# Altium schematic sheet Diagrama Final.SchDoc: Plataforma para robótica de enjambre fase 2
size A4; DrawnBy: Javier Lima; Revision: Pablo Mazariegos; SheetNumber: 1
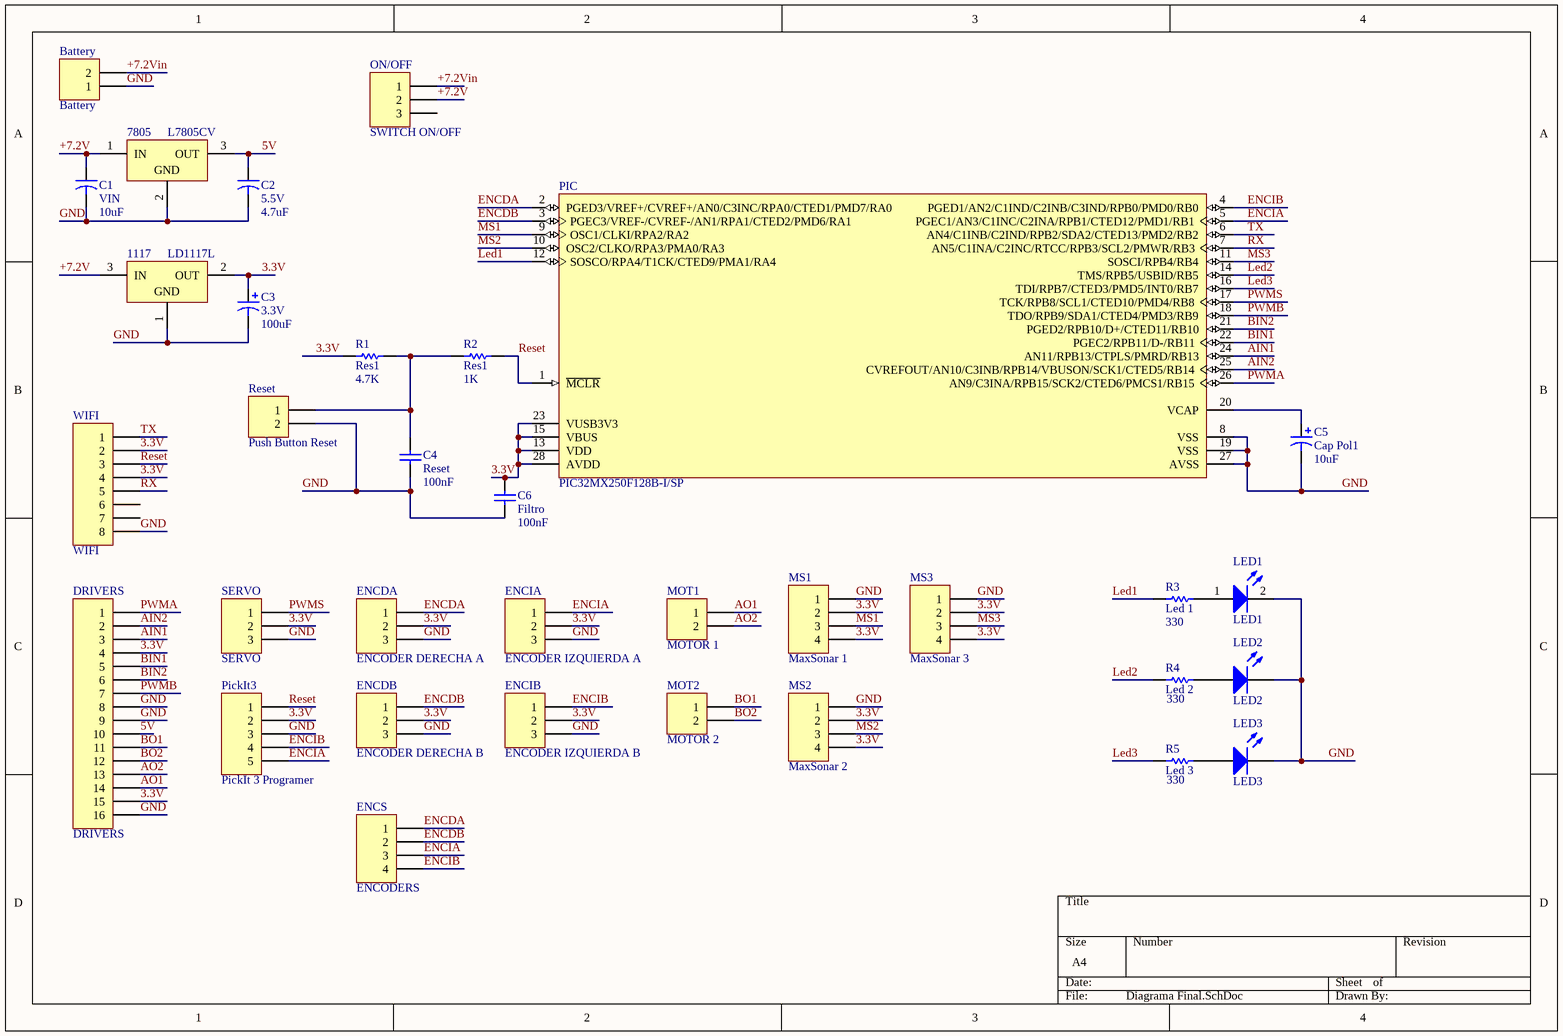
[diagram p0: Diagrama Final.SchDoc]

## Parts
1117  LD1117L  [REG LD1117]
7805  L7805CV  [REG 7805]
Battery  Battery  [BATERIA]
C1  VIN  value 10uF  [Cap 10uF]
C2  5.5V  value 4.7uF  [Cap 4.7uF]
C3  3.3V  value 100uF  [Cap 100uF]
C4  Reset  value 100nF  [Cap 100nF]
C5  Cap Pol1  value 10uF  [Cap 10uF]
C6  Filtro  value 100nF  [Cap 100nF]
DRIVERS  DRIVERS  [Drivers]
ENCDA  ENCODER DERECHA A  [ENCODER]
ENCDB  ENCODER DERECHA B  [ENCODER]
ENCIA  ENCODER IZQUIERDA A  [ENCODER]
ENCIB  ENCODER IZQUIERDA B  [ENCODER]
ENCS  ENCODERS  [PINES - 4]
LED1  LED1  [LED]
LED2  LED2  [LED]
LED3  LED3  [LED]
MOT1  MOTOR 1  [MOTOR]
MOT2  MOTOR 2  [MOTOR]
MS1  MaxSonar 1  [MaxSonar]
MS2  MaxSonar 2  [MaxSonar]
MS3  MaxSonar 3  [MaxSonar]
ON/OFF  SWITCH ON/OFF  [Switch ON/OFF]
PIC  PIC32MX250F128B-I/SP  [Camita-28]
PickIt3  PickIt 3 Programer  [PINES - 5]
R1  Res1  value 4.7K  [Resistor]
R2  Res1  value 1K  [Resistor]
R3  Led 1  value 330  [Resistor]
R4  Led 2  value 330  [Resistor]
R5  Led 3  value 330  [Resistor]
Reset  Push Button Reset  [Push Button]
SERVO  SERVO  [SERVO]
WIFI  WIFI  [WIFI]

## Nets
3.3V: 1117.2(OUT) C3.1 C6.1 DRIVERS.4 DRIVERS.15 ENCDA.2 ENCDB.2 ENCIA.2 ENCIB.2 MS1.2 MS1.4 MS2.2 MS2.4 MS3.2 MS3.4 PIC.13(VDD) PIC.15(VBUS) PIC.23(VUSB3V3) PIC.28(AVDD) PickIt3.2 R1.2 SERVO.2 WIFI.2 WIFI.4
5V: 7805.3(OUT) C2.1 DRIVERS.10
+7.2V: 1117.3(IN) 7805.1(IN) C1.1 ON/OFF.2
+7.2Vin: Battery.2 ON/OFF.1
AIN1: DRIVERS.3 PIC.24(AN11/RPB13/CTPLS/PMRD/RB13)
AIN2: DRIVERS.2 PIC.25(CVREFOUT/AN10/C3INB/RPB14/VBUSON/SCK1/CTED5/RB14)
AO1: DRIVERS.14 MOT1.1
AO2: DRIVERS.13 MOT1.2
BIN1: DRIVERS.5 PIC.22(PGEC2/RPB11/D-/RB11)
BIN2: DRIVERS.6 PIC.21(PGED2/RPB10/D+/CTED11/RB10)
BO1: DRIVERS.11 MOT2.1
BO2: DRIVERS.12 MOT2.2
ENCDA: ENCDA.1 ENCS.1 PIC.2(PGED3/VREF+/CVREF+/AN0/C3INC/RPA0/CTED1/PMD7/RA0)
ENCDB: ENCDB.1 ENCS.2 PIC.3(PGEC3/VREF-/CVREF-/AN1/RPA1/CTED2/PMD6/RA1)
ENCIA: ENCIA.1 ENCS.3 PIC.5(PGEC1/AN3/C1INC/C2INA/RPB1/CTED12/PMD1/RB1) PickIt3.5
ENCIB: ENCIB.1 ENCS.4 PIC.4(PGED1/AN2/C1IND/C2INB/C3IND/RPB0/PMD0/RB0) PickIt3.4
GND: 1117.1(GND) 7805.2(GND) Battery.1 C1.2 C2.2 C3.2 C4.2 C5.2 C6.2 DRIVERS.8 DRIVERS.9 DRIVERS.16 ENCDA.3 ENCDB.3 ENCIA.3 ENCIB.3 LED1.2(K) LED2.2(K) LED3.2(K) MS1.1 MS2.1 MS3.1 PIC.8(VSS) PIC.19(VSS) PIC.27(AVSS) PickIt3.3 Reset.2 SERVO.3 WIFI.8
Led1: PIC.12(SOSCO/RPA4/T1CK/CTED9/PMA1/RA4) R3.2
Led2: PIC.14(TMS/RPB5/USBID/RB5) R4.2
Led3: PIC.16(TDI/RPB7/CTED3/PMD5/INT0/RB7) R5.2
MS1: MS1.3 PIC.9(OSC1/CLKI/RPA2/RA2)
MS2: MS2.3 PIC.10(OSC2/CLKO/RPA3/PMA0/RA3)
MS3: MS3.3 PIC.11(SOSCI/RPB4/RB4)
PWMA: DRIVERS.1 PIC.26(AN9/C3INA/RPB15/SCK2/CTED6/PMCS1/RB15)
PWMB: DRIVERS.7 PIC.18(TDO/RPB9/SDA1/CTED4/PMD3/RB9)
PWMS: PIC.17(TCK/RPB8/SCL1/CTED10/PMD4/RB8) SERVO.1
Reset: PIC.1(~{MCLR}) PickIt3.1 R2.1 WIFI.3
RX: PIC.7(AN5/C1INA/C2INC/RTCC/RPB3/SCL2/PMWR/RB3) WIFI.5
TX: PIC.6(AN4/C1INB/C2IND/RPB2/SDA2/CTED13/PMD2/RB2) WIFI.1
NetC4_1: C4.1 R1.1 R2.2 Reset.1
NetC5_1: C5.1 PIC.20(VCAP)
NetLED1_1: LED1.1(A) R3.1
NetLED2_1: LED2.1(A) R4.1
NetLED3_1: LED3.1(A) R5.1

Not connected (* = marked no-connect by the designer): ON/OFF 3; WIFI 6 7

## Library data of the parts
1117 7805 = L7812ABV: Precision 1A Regulator; Valor: 12; Published: 24-Aug-2001; LatestRevisionDate: 17-Jul-2002; LatestRevisionNote: Re-released for DXP Platform.; DatasheetVersion: Nov-1999; PackageVersion: Jun-1998; PackageReference: TO220ABN; Publisher: Altium Limited; PackageDescription: TO, Thru-Hole, Vertical, Heatsink Mounted; 3 In-Line Leads; Pitch 2.54 mm; Pin sequence 1, 3, 2; ComponentLink1Description: Manufacturer Link; ComponentLink1URL: http://www.st.com/; ComponentLink2Description: Datasheet; ComponentLink2URL: http://www.st.com/stonline/products/literature/ds/2144/l7805ab.pdf
Battery MOT1 MOT2 Reset = Header 2: Header, 2-Pin; LatestRevisionDate: 17-Jul-2002; LatestRevisionNote: Re-released for DXP Platform.; Publisher: Altium Limited
C1 C2 = Cap2: Capacitor; Valor: 1; Published: 23-Sep-2002; PackageReference: CAPR5-4X5; Publisher: Altium Limited; PackageDescription: Capacitor; 2 Leads
C3 C5 = Cap Pol1: Polarized Capacitor (Radial); Published: 8-Jun-2000; LatestRevisionDate: 17-Jul-2002; LatestRevisionNote: Re-released for DXP Platform.; PackageReference: RB7.6-15; Publisher: Altium Limited; PackageDescription: Polarized Capacitor (Radial); 2 Leads
C4 C6 = Cap: Capacitor; Published: 8-Jun-2000; LatestRevisionDate: 17-Jul-2002; LatestRevisionNote: Re-released for DXP Platform.; PackageReference: RAD-0.3; Publisher: Altium Limited; PackageDescription: Radial Cap, Thru-Hole; 2 Leads; 0.3 in Pin Spacing
DRIVERS = Header 16: Header, 16-Pin; LatestRevisionDate: 17-Jul-2002; LatestRevisionNote: Re-released for DXP Platform.; Publisher: Altium Limited
ENCDA ENCDB ENCIA ENCIB ON/OFF SERVO = Header 3: Header, 3-Pin; LatestRevisionDate: 17-Jul-2002; LatestRevisionNote: Re-released for DXP Platform.; Publisher: Altium Limited
ENCS MS1-MS3 = Header 4: Header, 4-Pin; LatestRevisionDate: 17-Jul-2002; LatestRevisionNote: Re-released for DXP Platform.; Publisher: Altium Limited
LED1-LED3 = LED0: Typical INFRARED GaAs LED; Published: 8-Jun-2000; LatestRevisionDate: 08-Jul-2005; LatestRevisionNote: Mech Layer 1 removed.; PackageReference: LED-0; Publisher: Altium Limited; PackageDescription: LED; 2 Leads
PIC = PIC32MX250F128B-I/SP: 32-bit Microcontroller with Audio and Graphics Interface, USB and Advanced Analog, 50 MHz, 19 I/O, PMP, -40 to 85 degC, 28-pin SPDIP (SP28), Tube; Manufacturer: Microchip; DatasheetVersion: Rev. E; PackageVersion: C04-070B; PackageReference: SPDIP-SP28; PackageDescription: 28-Lead Plastic Dual In-Line, 34.86 x 6.79 mm Body, 2.54 mm Pitch; Supplier 1: Digi-Key; Supplier Part Number 1: PIC32MX250F128B-I/SP-ND; Supplier 2: Farnell; Supplier Part Number 2: 2097773; Supplier 3: Newark; Supplier Part Number 3: 73T1453; Supplier 4: Mouser; Supplier Part Number 4: 579-32MX250F128BISP; Mounting Technology: Through Hole; PartNumber: PIC32MX250F128B-I/SP; ComponentLink1Description: Manufacturer URL; ComponentLink1URL: http://www.microchip.com; ComponentLink2Description: Datasheet; ComponentLink2URL: http://ww1.microchip.com/downloads/en/DeviceDoc/61168E.pdf; ComponentLink3Description: Package Specification; ComponentLink3URL: http://www.microchip.com/stellent/groups/techpub_sg/documents/packagingspec/en012702.pdf; ComponentLink4Description: Product URL; ComponentLink4URL: http://www.microchip.com/PIC32MX250F128B
PickIt3 = Header 5: Header, 5-Pin; LatestRevisionDate: 17-Jul-2002; LatestRevisionNote: Re-released for DXP Platform.; Publisher: Altium Limited
R1-R5 = Res1: Resistor; Published: 8-Jun-2000; LatestRevisionDate: 17-Jul-2002; LatestRevisionNote: Re-released for DXP Platform.; PackageReference: AXIAL-0.3; Publisher: Altium Limited; PackageDescription: Axial Device, Thru-Hole; 2 Leads; 0.3 in Pin Spacing
WIFI = Header 8: Header, 8-Pin; LatestRevisionDate: 17-Jul-2002; LatestRevisionNote: Re-released for DXP Platform.; Publisher: Altium Limited